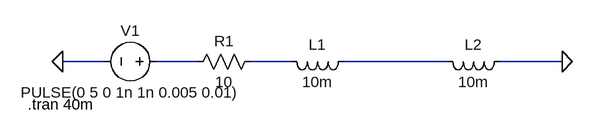
[diagram p0: schematic proje2_esd.asc]
proje2_esd.asc, the LTspice schematic file:
Version 4
SHEET 1 880 680
WIRE -48 96 -112 96
WIRE 96 96 32 96
WIRE 240 96 176 96
WIRE 480 96 320 96
WIRE 656 96 560 96
FLAG 656 96 0
FLAG -112 96 0
SYMBOL ind 336 80 R90
WINDOW 0 5 56 VBottom 2
WINDOW 3 32 56 VTop 2
SYMATTR InstName L1
SYMATTR Value 10m
SYMBOL ind 576 80 R90
WINDOW 0 5 56 VBottom 2
WINDOW 3 32 56 VTop 2
SYMATTR InstName L2
SYMATTR Value 10m
SYMBOL res 192 80 R90
WINDOW 0 0 56 VBottom 2
WINDOW 3 32 56 VTop 2
SYMATTR InstName R1
SYMATTR Value 10
SYMBOL voltage 48 96 R90
WINDOW 0 -32 56 VBottom 2
WINDOW 3 32 56 VTop 2
WINDOW 123 0 0 Left 0
WINDOW 39 0 0 Left 0
SYMATTR InstName V1
SYMATTR Value PULSE(0 5 0 1n 1n 0.005 0.01)
TEXT -166 162 Left 2 !.tran 40m

The netlist it stands for:
* proje2_esd.asc
L1 N003 N002 10m
L2 0 N003 10m
R1 N002 N001 10
V1 N001 0 PULSE(0 5 0 1n 1n 0.005 0.01)
.tran 40m
.backanno
.end